# EAGLE design ConstantCurrentSupply_PNP_SCH (EAGLE 6.3)
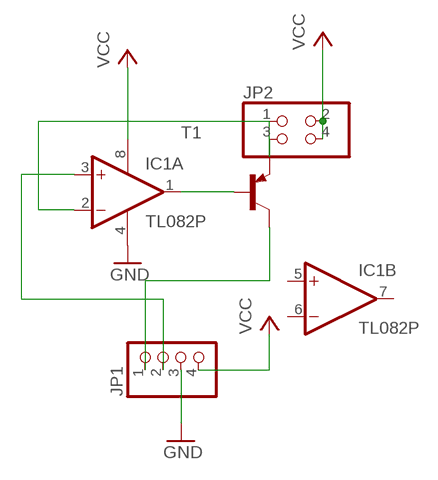
[diagram p0: schematic, sheet 1]

## Parts
IC1  TL082P  [DIL08]
JP1  PINHD-1X4  [1X04]
JP2  PINHD-2X2  [2X02]
T1  2N3906-PNP-TO92-EBC  [TO92-EBC]

## Nets
COLLECTOR: JP1.1 T1.C
GND: IC1.4(P:V-) JP1.3
OUT: IC1.1(A:OUT) T1.B
V+: IC1.3(A:+IN) JP1.2
V-: IC1.2(A:-IN) JP2.1 JP2.3 T1.E
VCC: IC1.8(P:V+) JP1.4 JP2.2 JP2.4
Unconnected: IC1.5(B:+IN) IC1.6(B:-IN) IC1.7(B:OUT)

## Library data of the parts
IC1 = linear:TL082: OP AMP
JP1 = pinhead:PINHD-1X4: PIN HEADER
JP2 = pinhead:PINHD-2X2: PIN HEADER
T1 = transistor-neu-to92:*-PNP-: PNP Transistror

## Board
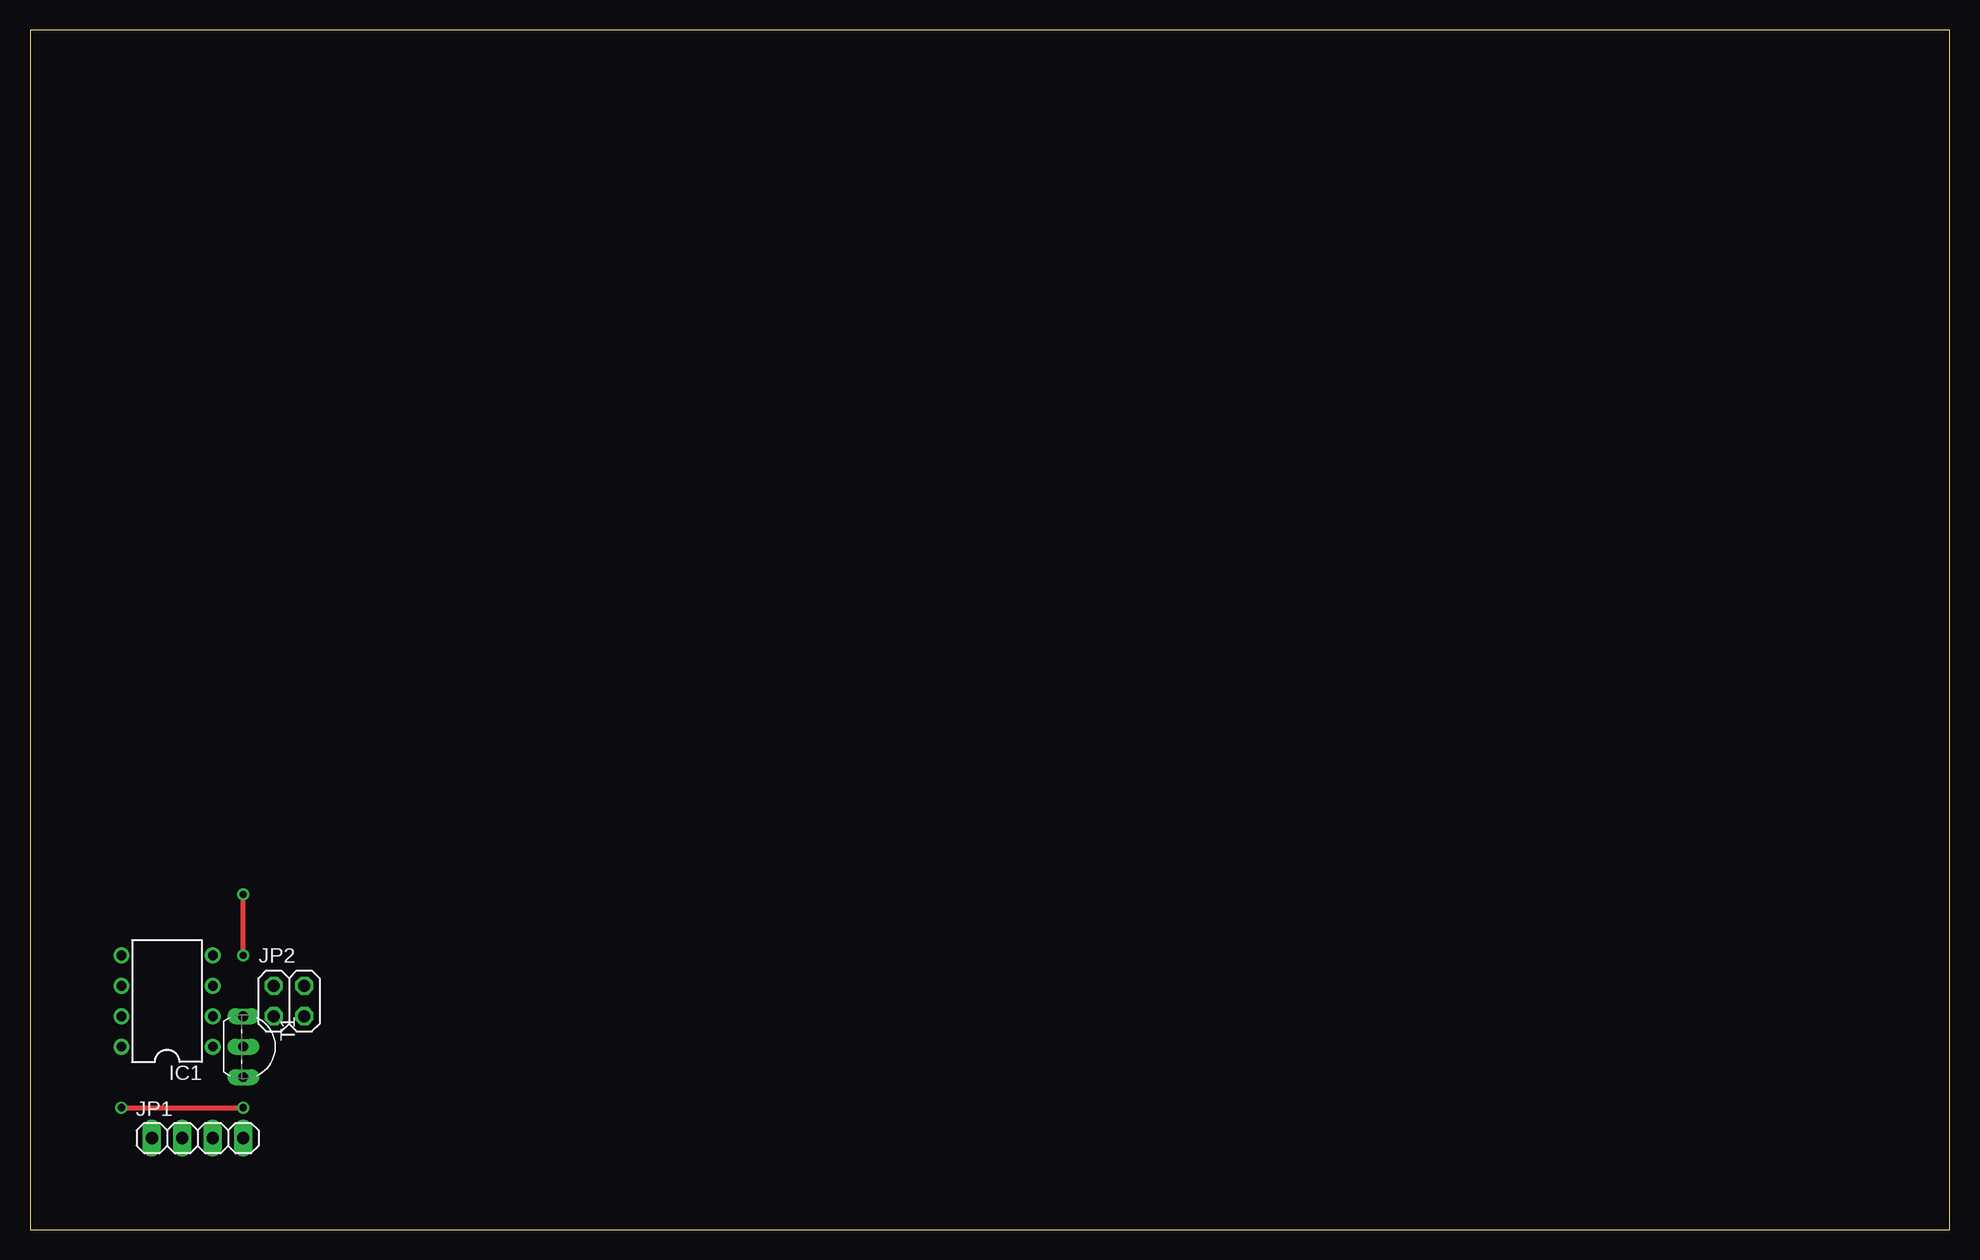
[diagram p1: board, top side]
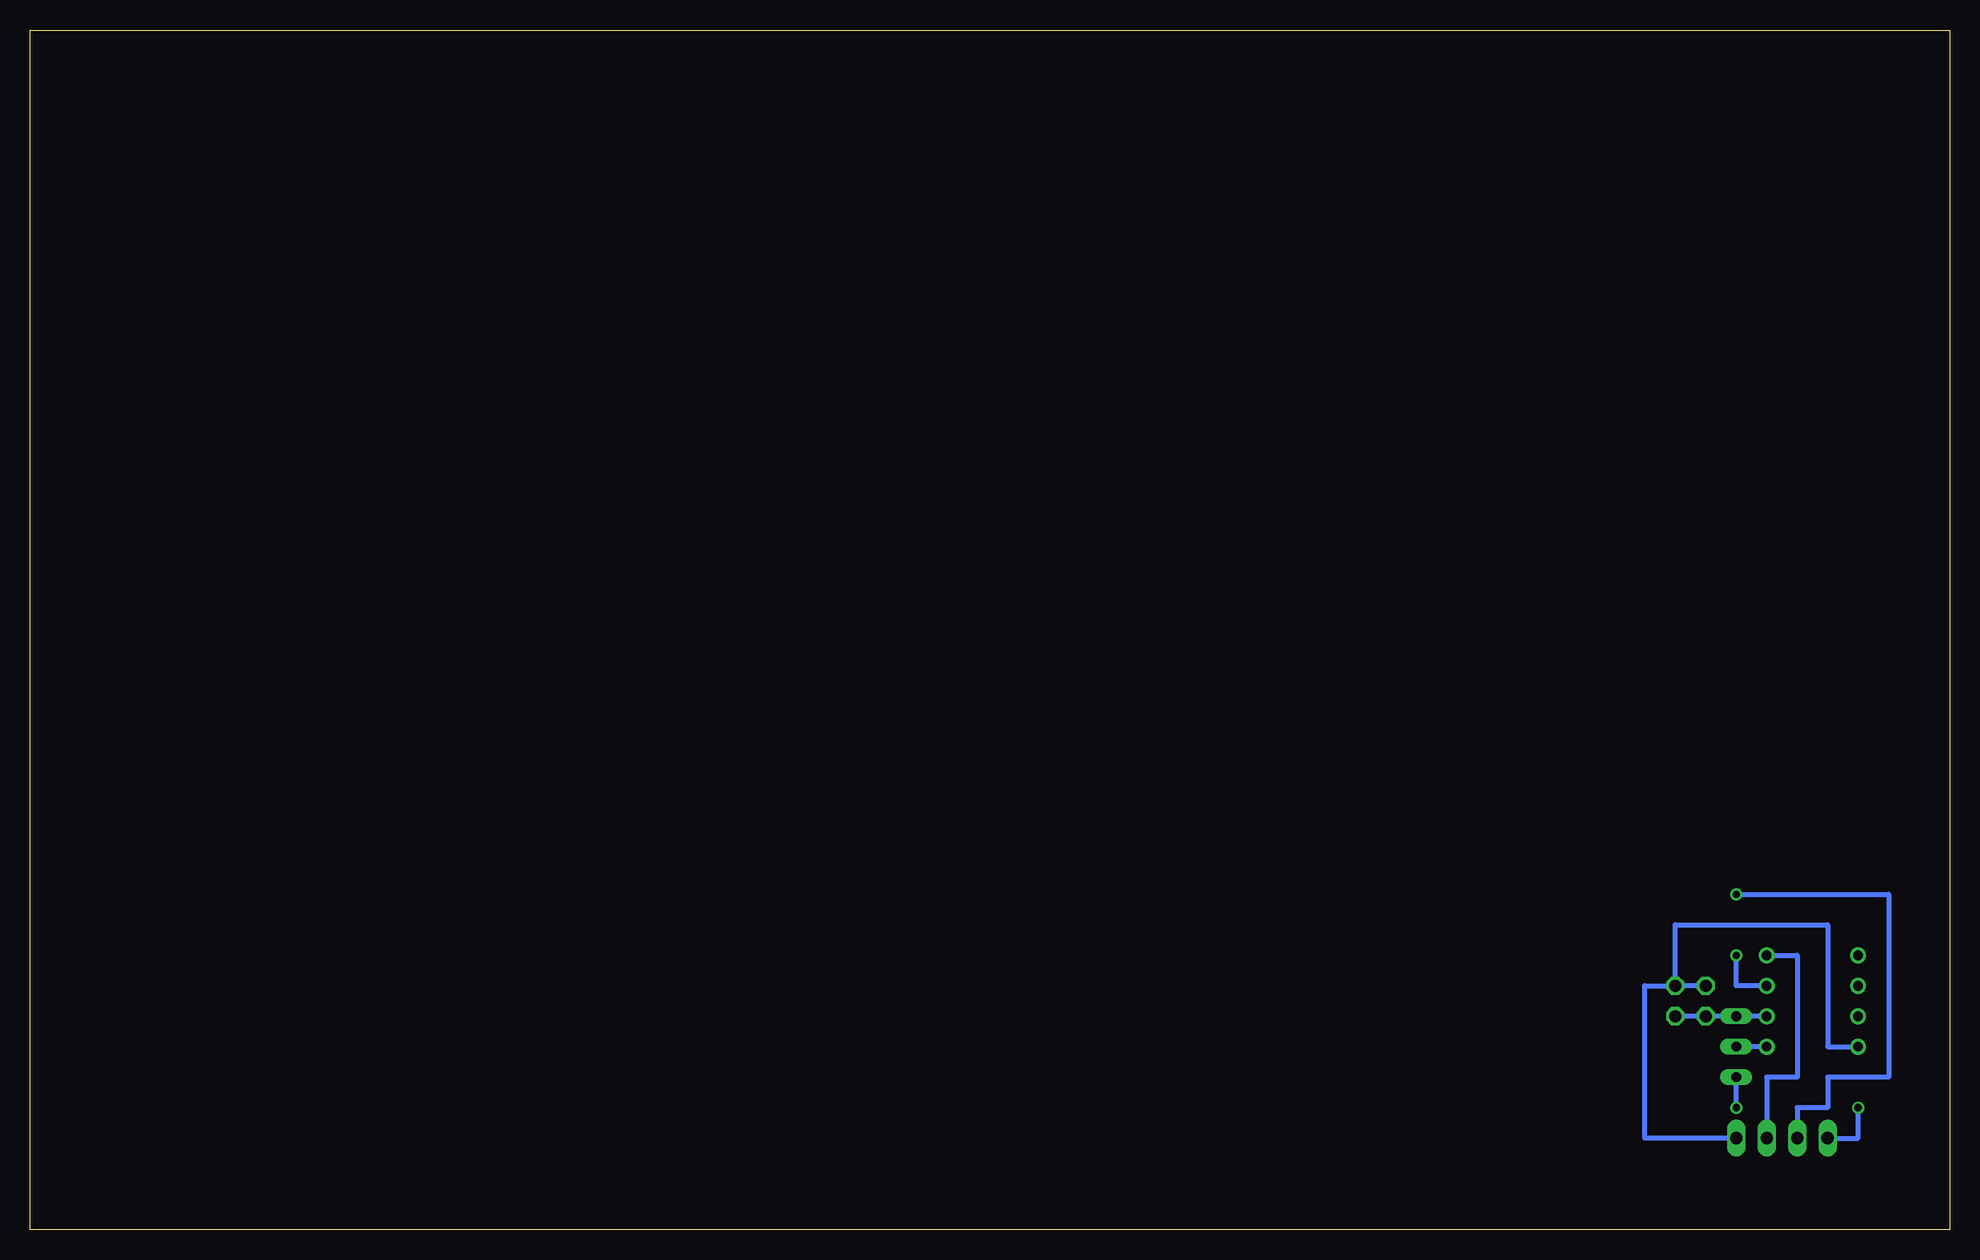
[diagram p2: board, bottom side, seen from below]

Size 160 x 100 mm. Coordinates in mm from the lower left corner, seen from the top.
Outline: 0,0 160,0 160,100 0,100 0,0
Copper layers (1*16): Top 0.035mm / dielectric 1.5mm / Bottom 0.035mm
Design rules "default": minimum track width 10mil, minimum drill 24mil, track to track 8mil, track to pad 8mil, pad to pad 8mil, via to via 8mil, smd to smd 8mil, copper to edge 40mil, drill to drill 8mil, minimum pad ring 10mil, minimum via ring 8mil, stop-mask expansion 4mil, vias tented up to drill 0mil, thermal gap 10mil

### Footprints (pad centres in the part's own frame; a part is rotated, then mirrored left to right if it is on the bottom)
DIL08 = drill 0.813 pad 1.27: 1 -3.81,-3.81; 2 -1.27,-3.81; 3 1.27,-3.81; 4 3.81,-3.81; 5 3.81,3.81; 6 1.27,3.81; 7 -1.27,3.81; 8 -3.81,3.81
1X04 = drill 1.016 long: 1 -3.81,0; 2 -1.27,0; 3 1.27,0; 4 3.81,0
2X02 = drill 1.016 octagon: 1 -1.27,-1.27; 2 -1.27,1.27; 3 1.27,-1.27; 4 1.27,1.27
TO92-EBC = drill 0.813 long: B 0,-1.27; C 2.54,-1.27; E -2.54,-1.27

### Placement (x,y rotation side)
IC1  11.43,19.05 90 top
JP1  13.97,7.62 0 top
JP2  21.59,19.05 0 top
T1  19.05,15.24 270 top

### Tracks (layer width: path | path; a pad name or v marks a point on that pad's centre or on a via)
COLLECTOR  (via drill 0.6)
  Top 0.406: v7.62,10.16 v17.78,10.16
  Bottom 0.406: JP1.1 7.62,7.62 v7.62,10.16 | v17.78,10.16 T1.C
GND
  Bottom 0.406: IC1.4 12.7,22.86 12.7,12.7 15.24,12.7 JP1.3
OUT
  Bottom 0.406: IC1.1 T1.B
V+  (via drill 0.6)
  Top 0.406: v17.78,22.86 v17.78,27.94
  Bottom 0.406: IC1.3 17.78,20.32 v17.78,22.86 | v17.78,27.94 5.08,27.94 5.08,12.7 10.16,12.7 10.16,10.16 12.7,10.16 JP1.2
V-
  Bottom 0.406: IC1.2 T1.E JP2.1 JP2.3
VCC
  Bottom 0.406: JP1.4 25.4,7.62 25.4,20.32 JP2.4 | JP2.2 JP2.4 | JP2.4 22.86,25.4 10.16,25.4 10.16,15.24 IC1.8